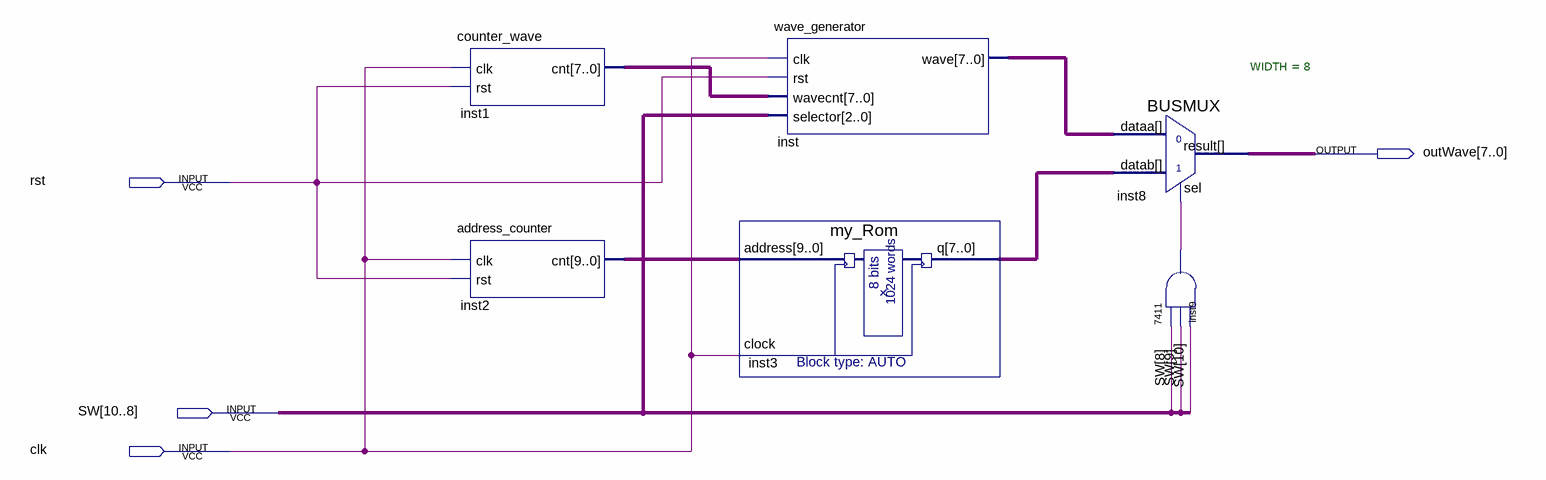
[diagram p0: schematic sheet]
// Quartus schematic Waveform_Generator.bdf as structural Verilog: 6 symbols, 4 pins
module Waveform_Generator (
  input  rst,
  input  [10:8] SW,
  input  clk,
  output [7:0] outWave
);

  wire inst9_1;
  wire [7:0] inst1_cnt, inst3_q, inst_wave;
  wire [9:0] inst2_cnt;

  counter_wave inst1 (.clk(clk), .rst(rst), .cnt(inst1_cnt));
  address_counter inst2 (.clk(clk), .rst(rst), .cnt(inst2_cnt));
  wave_generator inst (.clk(clk), .rst(rst), .wavecnt(inst1_cnt), .selector(SW), .wave(inst_wave));
  my_Rom inst3 (.address(inst2_cnt), .clock(clk), .q(inst3_q));
  BUSMUX #(.WIDTH(8)) inst8 (.datab(inst3_q), .sel(inst9_1), .dataa(inst_wave), .result(outWave));
  \7411  inst9 (.\2 (SW[8]), .\3 (SW[9]), .\4 (SW[10]), .\1 (inst9_1));
endmodule
